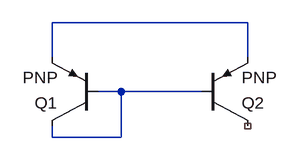
[diagram p0: schematic Draft1.asc]
Draft1.asc, the LTspice schematic file:
Version 4
SHEET 1 880 680
WIRE 336 0 64 0
WIRE 64 48 64 0
WIRE 336 48 336 0
WIRE 160 96 128 96
WIRE 272 96 160 96
WIRE 64 160 64 144
WIRE 160 160 160 96
WIRE 160 160 64 160
SYMBOL pnp 128 144 R180
SYMATTR InstName Q1
SYMBOL pnp 272 144 M180
SYMATTR InstName Q2

The netlist it stands for:
* Draft1.asc
Q1 N002 N002 N001 0 PNP
Q2 NC_01 N002 N001 0 PNP
.model NPN NPN
.model PNP PNP
.lib standard.bjt
.backanno
.end